# EAGLE schematic NavCom_Board_1 (EAGLE 7.2.0)
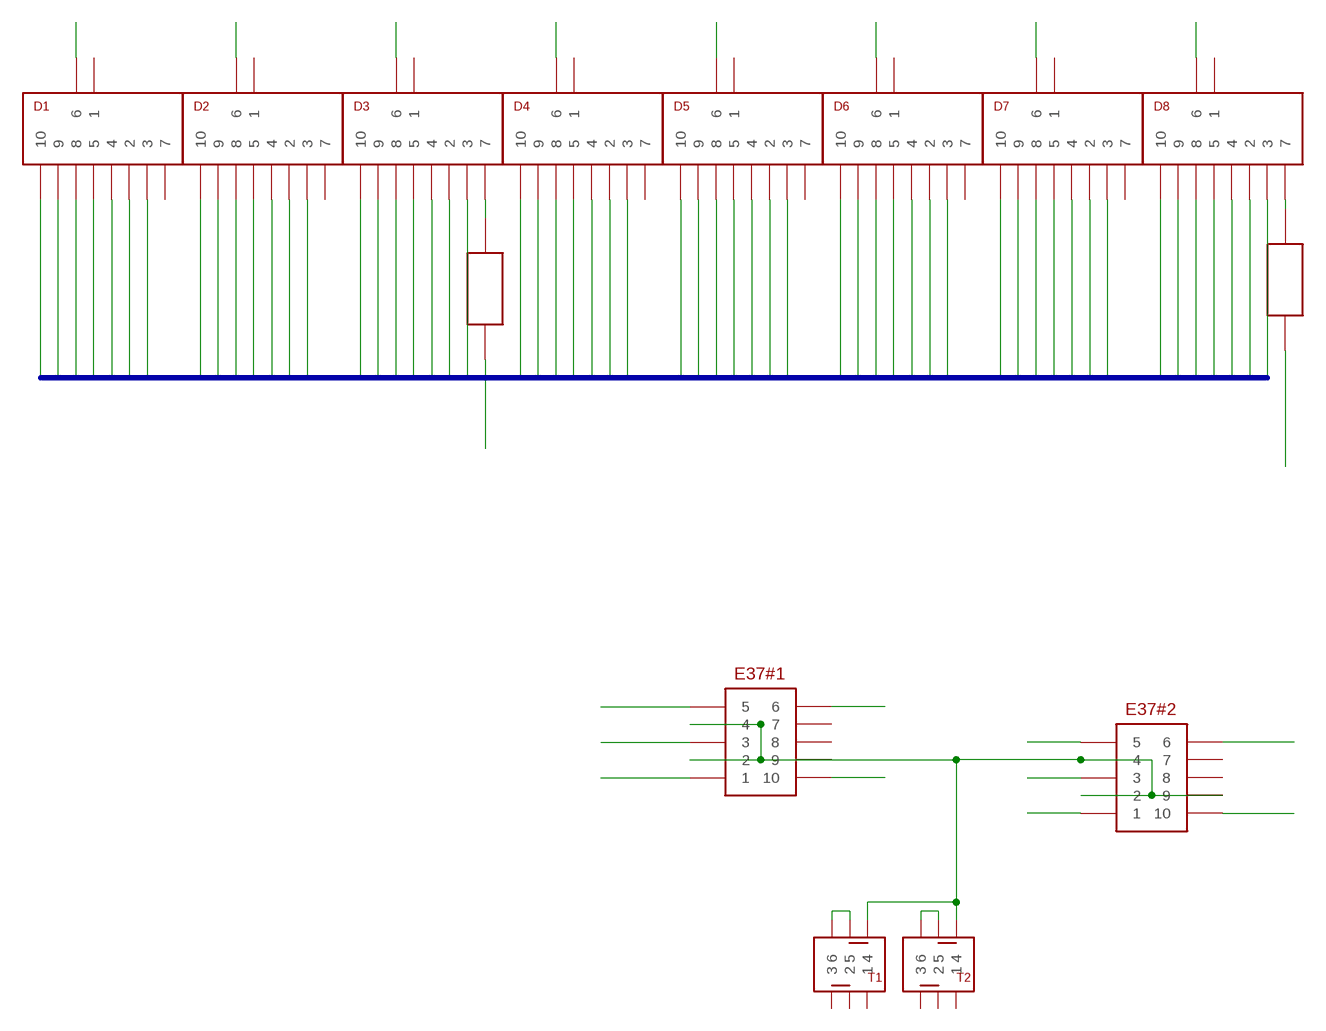
[diagram p0: schematic, sheet 1, part 1 of 2]
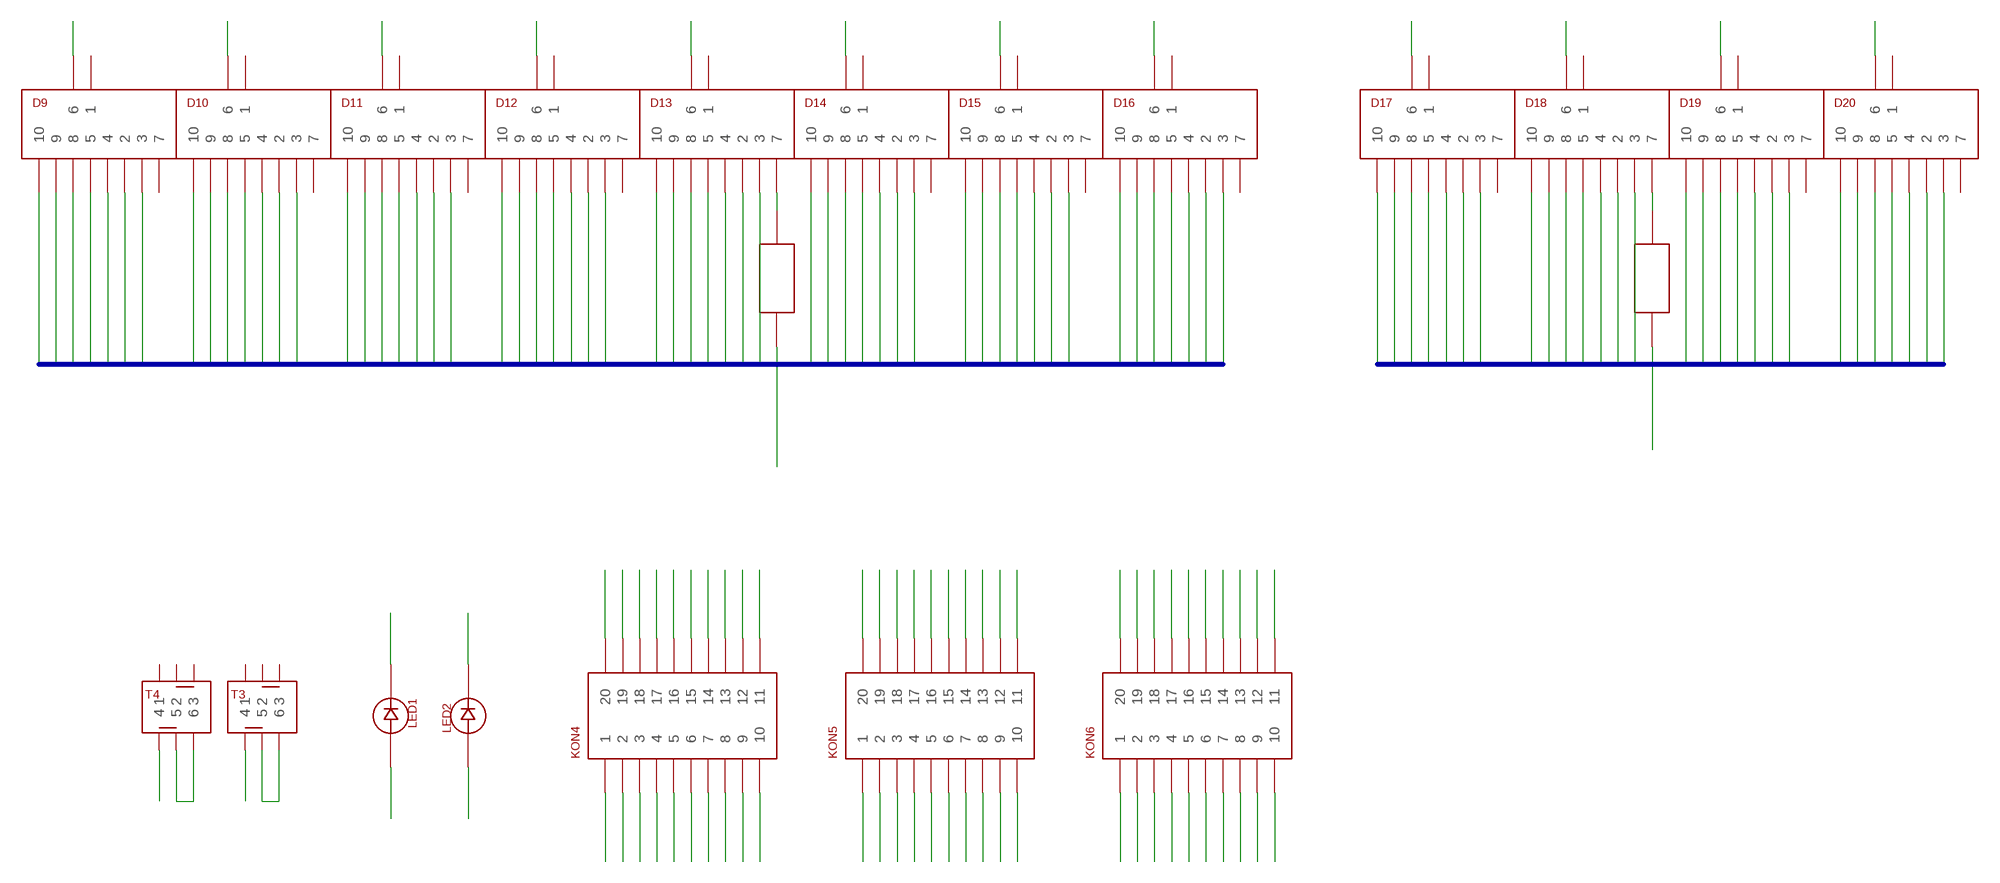
[diagram p1: schematic, sheet 1, part 2 of 2]

## Parts
D1  SA3611EWA  [SA3611EWA]
D2  SA3611EWA  [SA3611EWA]
D3  SA3611EWA  [SA3611EWA]
D4  SA3611EWA  [SA3611EWA]
D5  SA3611EWA  [SA3611EWA]
D6  SA3611EWA  [SA3611EWA]
D7  SA3611EWA  [SA3611EWA]
D8  SA3611EWA  [SA3611EWA]
D9  SA3611EWA  [SA3611EWA]
D10  SA3611EWA  [SA3611EWA]
D11  SA3611EWA  [SA3611EWA]
D12  SA3611EWA  [SA3611EWA]
D13  SA3611EWA  [SA3611EWA]
D14  SA3611EWA  [SA3611EWA]
D15  SA3611EWA  [SA3611EWA]
D16  SA3611EWA  [SA3611EWA]
D17  SA3611EWA  [SA3611EWA]
D18  SA3611EWA  [SA3611EWA]
D19  SA3611EWA  [SA3611EWA]
D20  SA3611EWA  [SA3611EWA]
E37#1  ELMA_E37  [ELMA_E37]
E37#2  ELMA_E37  [ELMA_E37]
KON4  LISTA_2X10  [LISTA_2X10]
KON5  LISTA_2X10  [LISTA_2X10]
KON6  LISTA_2X10  [LISTA_2X10]
LED1  LED_5MM  [LED_5MM]
LED2  LED_5MM  [LED_5MM]
T1  P1-0S  [P1-0S]
T2  P1-0S  [P1-0S]
T3  P1-0S  [P1-0S]
T4  P1-0S  [P1-0S]
U$1  REZISTOR  [REZISTOR]
U$2  REZISTOR  [REZISTOR]
U$3  REZISTOR  [REZISTOR]
U$4  REZISTOR  [REZISTOR]

## Nets
D1: D1.6 KON4.1
D2: D2.6 KON4.2
D3: D3.6 KON4.9
D4: D4.6 KON4.6
D5: D5.6 KON4.3
D6: D6.6 KON4.8
D7: D7.6 KON4.7
D8: D8.6 KON4.4
D9: D9.6 KON5.1
D10: D10.6 KON5.2
D11: D11.6 KON5.9
D12: D12.6 KON5.6
D13: D13.6 KON5.3
D14: D14.6 KON5.8
D15: D15.6 KON5.7
D16: D16.6 KON5.4
D17: D17.6 KON6.1
D18: D18.6 KON6.2
D19: D19.6 KON6.9
D20: D20.6 KON6.6
DRIVER1_SEG2: D1.2 D2.2 D3.2 D4.2 D5.2 D6.2 D7.2 D8.2 KON4.10
DRIVER1_SEG3: D1.3 D2.3 D3.3 D4.3 D5.3 D6.3 D7.3 D8.3 KON4.12
DRIVER1_SEG4: D1.4 D2.4 D3.4 D4.4 D5.4 D6.4 D7.4 D8.4 KON4.15
DRIVER1_SEG5: D1.5 D2.5 D3.5 D4.5 D5.5 D6.5 D7.5 D8.5 KON4.16
DRIVER1_SEG8: D1.8 D2.8 D3.8 D4.8 D5.8 D6.8 D7.8 D8.8 KON4.14
DRIVER1_SEG9: D1.9 D2.9 D3.9 D4.9 D5.9 D6.9 D7.9 D8.9 KON4.11
DRIVER1_SEG10: D1.10 D2.10 D3.10 D4.10 D5.10 D6.10 D7.10 D8.10 KON4.13
DRIVER2_SEG2: D9.2 D10.2 D11.2 D12.2 D13.2 D14.2 D15.2 D16.2 KON5.10
DRIVER2_SEG3: D9.3 D10.3 D11.3 D12.3 D13.3 D14.3 D15.3 D16.3 KON5.12
DRIVER2_SEG4: D9.4 D10.4 D11.4 D12.4 D13.4 D14.4 D15.4 D16.4 KON5.15
DRIVER2_SEG5: D9.5 D10.5 D11.5 D12.5 D13.5 D14.5 D15.5 D16.5 KON5.16
DRIVER2_SEG8: D9.8 D10.8 D11.8 D12.8 D13.8 D14.8 D15.8 D16.8 KON5.14
DRIVER2_SEG9: D9.9 D10.9 D11.9 D12.9 D13.9 D14.9 D15.9 D16.9 KON5.11
DRIVER2_SEG10: D9.10 D10.10 D11.10 D12.10 D13.10 D14.10 D15.10 D16.10 KON5.13
DRIVER3_SEG2: D17.2 D18.2 D19.2 D20.2 KON6.10
DRIVER3_SEG3: D17.3 D18.3 D19.3 D20.3 KON6.12
DRIVER3_SEG4: D17.4 D18.4 D19.4 D20.4 KON6.15
DRIVER3_SEG5: D17.5 D18.5 D19.5 D20.5 KON6.16 LED1.P$2 LED2.P$2
DRIVER3_SEG8: D17.8 D18.8 D19.8 D20.8 KON6.14
DRIVER3_SEG9: D17.9 D18.9 D19.9 D20.9 KON6.11
DRIVER3_SEG10: D17.10 D18.10 D19.10 D20.10 KON6.13
E37#1_1: E37#1.1 KON4.17
E37#1_3: E37#1.3 KON4.18
E37#1_5: E37#1.5 KON4.20
E37#1_6: E37#1.6 KON4.19
E37#1_10: E37#1.10 KON4.5
E37#2_1: E37#2.1 KON6.17
E37#2_3: E37#2.3 KON6.18
E37#2_5: E37#2.5 KON6.20
E37#2_6: E37#2.6 KON6.19
E37#2_10: E37#2.10 KON6.5
GND: E37#1.2 E37#1.4 E37#1.9 E37#2.2 E37#2.4 E37#2.9 KON5.5 T1.4 T2.4 T3.5 T3.6 T4.5 T4.6 U$1.P$1 U$2.P$1 U$3.P$1 U$4.P$1
LED1: KON6.3 LED1.P$1
LED2: KON6.8 LED2.P$1
N$2: D3.7 U$4.P$2
N$3: D18.7 U$2.P$2
N$4: D13.7 U$1.P$2
N$5: D8.7 U$3.P$2
N$33: KON6.4
N$42: KON6.7
T1: KON5.20 T1.5 T1.6
T2: KON5.19 T2.5 T2.6
T3: KON5.18 T3.4
T4: KON5.17 T4.4
Unconnected: D1.1 D1.7 D2.1 D2.7 D3.1 D4.1 D4.7 D5.1 D5.7 D6.1 D6.7 D7.1 D7.7 D8.1 D9.1 D9.7 D10.1 D10.7 D11.1 D11.7 D12.1 D12.7 D13.1 D14.1 D14.7 D15.1 D15.7 D16.1 D16.7 D17.1 D17.7 D18.1 D19.1 D19.7 D20.1 D20.7 E37#1.7 E37#1.8 E37#2.7 E37#2.8 T1.1 T1.2 T1.3 T2.1 T2.2 T2.3 T3.1 T3.2 T3.3 T4.1 T4.2 T4.3

## Buses
B$1
B$2
B$3

## Library data of the parts
D1-D20 = RadioStack_v2:SA3611EWA
E37#1 E37#2 = RadioStack_v2:ELMA_E37
KON4-KON6 = RadioStack_v2:LISTA_2X10
LED1 LED2 = RadioStack_v2:LED_5MM
T1-T4 = RadioStack_v2:P1-0S
U$1-U$4 = RadioStack_v2:REZISTOR